# Altium schematic sheet SUBBOARD-sensors.SchDoc
size A4
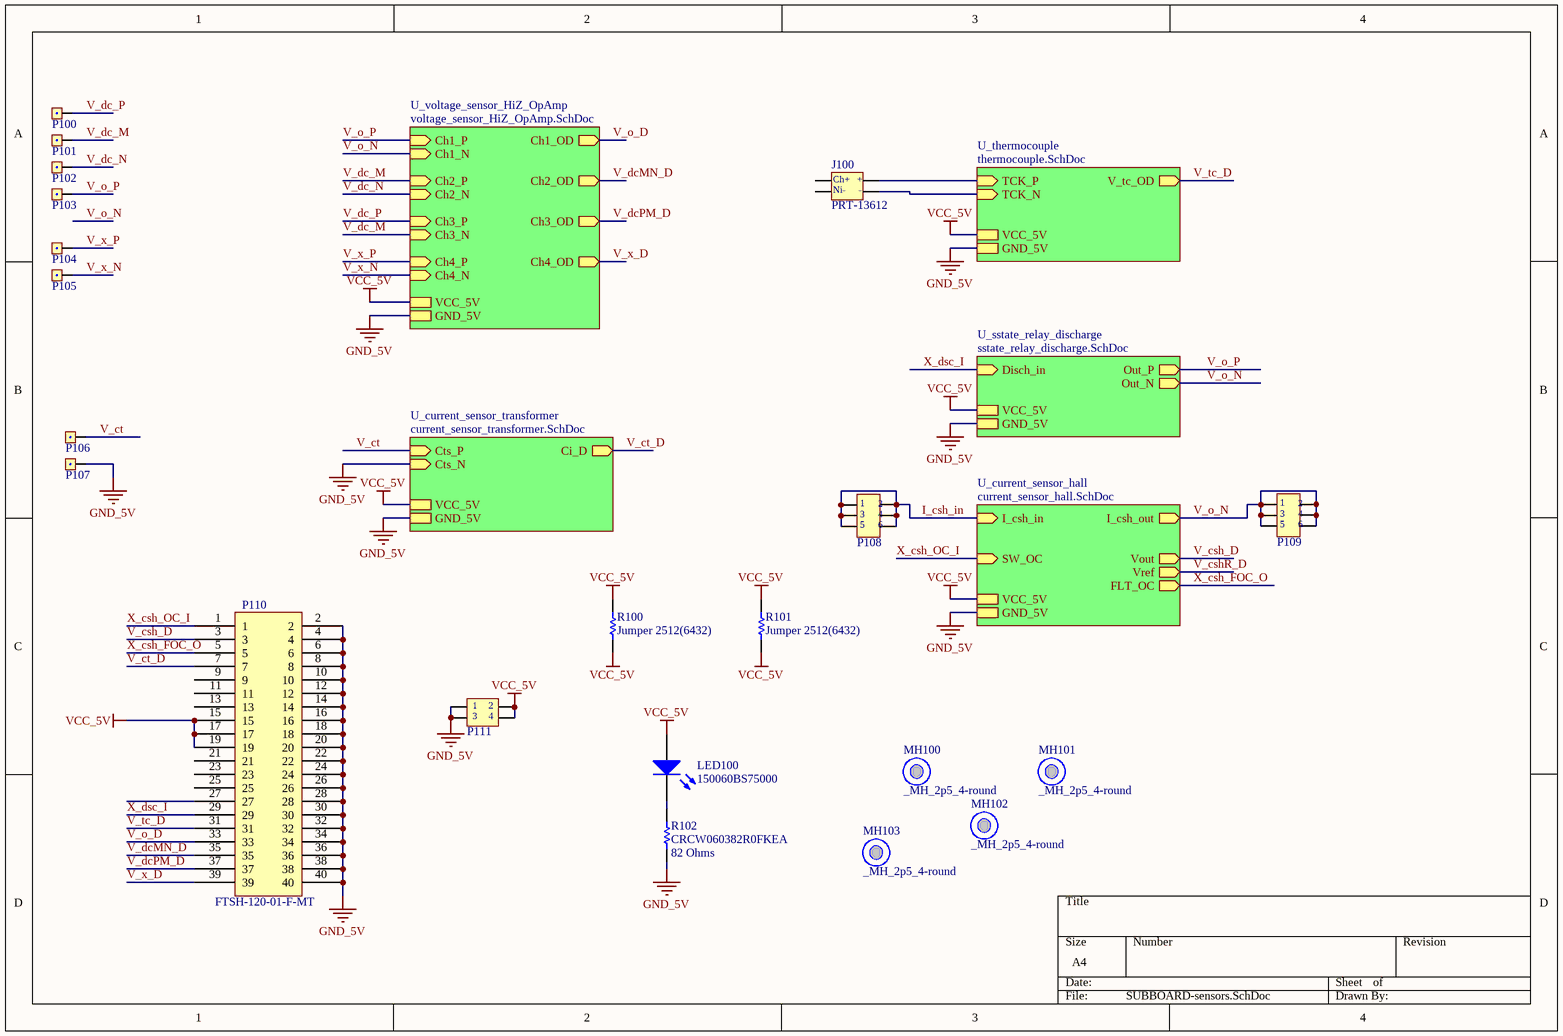
[diagram p0: SUBBOARD-sensors.SchDoc]

## Parts
J100  PRT-13612  [PRT-13612]
LED100  150060BS75000  [0603_A]
MH100  _MH_2p5_4-round  [_MH_2p5_4-round]
MH101  _MH_2p5_4-round  [_MH_2p5_4-round]
MH102  _MH_2p5_4-round  [_MH_2p5_4-round]
MH103  _MH_2p5_4-round  [_MH_2p5_4-round]
P100  TSW-101-15-G-S  [TSW-101-15-G-S]  (value not drawn)
P101  TSW-101-15-G-S  [TSW-101-15-G-S]  (value not drawn)
P102  TSW-101-15-G-S  [TSW-101-15-G-S]  (value not drawn)
P103  TSW-101-15-G-S  [TSW-101-15-G-S]  (value not drawn)
P104  TSW-101-15-G-S  [TSW-101-15-G-S]  (value not drawn)
P105  TSW-101-15-G-S  [TSW-101-15-G-S]  (value not drawn)
P106  TSW-101-15-G-S  [TSW-101-15-G-S]  (value not drawn)
P107  TSW-101-15-G-S  [TSW-101-15-G-S]  (value not drawn)
P108  TSW-103-15-G-D  [TSW-103-15-G-D]  (value not drawn)
P109  TSW-103-15-G-D  [TSW-103-15-G-D]  (value not drawn)
P110  FTSH-120-01-F-MT  [FTSH-120-01-F-MT]
P111  TMM-102-02-T-D  [TMM-102-02-T-D]  (value not drawn)
R100  Jumper 2512(6432)  [RESC2512(6432)_L]
R101  Jumper 2512(6432)  [RESC2512(6432)_L]
R102  CRCW060382R0FKEA  value 82 Ohms  [RESC1609X50X30LL10T20]

## Sub-sheets
U_current_sensor_hall = current_sensor_hall.SchDoc: I_csh_in (in), I_csh_out (out), VCC_5V, GND_5V, Vout (out), Vref (out), FLT_OC (out), SW_OC (in)
U_current_sensor_transformer = current_sensor_transformer.SchDoc: VCC_5V, GND_5V, Cts_P (in), Cts_N (in), Ci_D (out)
U_sstate_relay_discharge = sstate_relay_discharge.SchDoc: VCC_5V, GND_5V, Disch_in (in), Out_P (out), Out_N (out)
U_thermocouple = thermocouple.SchDoc: V_tc_OD (out), VCC_5V, GND_5V, TCK_P (in), TCK_N (in)
U_voltage_sensor_HiZ_OpAmp = voltage_sensor_HiZ_OpAmp.SchDoc: VCC_5V, GND_5V, Ch1_OD (out), Ch2_OD (out), Ch3_OD (out), Ch4_OD (out), Ch1_N (in), Ch1_P (in), Ch2_N (in), Ch2_P (in), Ch3_N (in), Ch3_P (in), Ch4_N (in), Ch4_P (in)

## Nets
GND_5V: P107.1 P110.2 P110.4 P110.6 P110.8 P110.10 P110.12 P110.14 P110.16 P110.18 P110.20 P110.22 P110.24 P110.26 P110.28 P110.30 P110.32 P110.34 P110.36 P110.38 P110.40 P111.1 P111.3 R102.2 ; sheet U_voltage_sensor_HiZ_OpAmp/GND_5V, sheet U_current_sensor_hall/GND_5V, sheet U_current_sensor_transformer/GND_5V, sheet U_current_sensor_transformer/Cts_N, sheet U_thermocouple/GND_5V, sheet U_sstate_relay_discharge/GND_5V
VCC_5V: LED100.2(A) P110.15 P110.17 P110.19 P111.2 P111.4 R100.1 R100.2 R101.1 R101.2 ; sheet U_voltage_sensor_HiZ_OpAmp/VCC_5V, sheet U_current_sensor_hall/VCC_5V, sheet U_current_sensor_transformer/VCC_5V, sheet U_thermocouple/VCC_5V, sheet U_sstate_relay_discharge/VCC_5V
I_csh_in: P108.1 P108.2 P108.3 P108.4 P108.5 P108.6 ; sheet U_current_sensor_hall/I_csh_in
V_csh_D: P110.3 ; sheet U_current_sensor_hall/Vout
V_cshR_D: sheet U_current_sensor_hall/Vref
V_ct: P106.1 ; sheet U_current_sensor_transformer/Cts_P
V_ct_D: P110.7 ; sheet U_current_sensor_transformer/Ci_D
V_dc_M: P101.1 ; sheet U_voltage_sensor_HiZ_OpAmp/Ch2_P, sheet U_voltage_sensor_HiZ_OpAmp/Ch3_N
V_dc_N: P102.1 ; sheet U_voltage_sensor_HiZ_OpAmp/Ch2_N
V_dc_P: P100.1 ; sheet U_voltage_sensor_HiZ_OpAmp/Ch3_P
V_dcMN_D: P110.35 ; sheet U_voltage_sensor_HiZ_OpAmp/Ch2_OD
V_dcPM_D: P110.37 ; sheet U_voltage_sensor_HiZ_OpAmp/Ch3_OD
V_o_D: P110.33 ; sheet U_voltage_sensor_HiZ_OpAmp/Ch1_OD
V_o_N: P109.1 P109.2 P109.3 P109.4 P109.5 P109.6 ; sheet U_voltage_sensor_HiZ_OpAmp/Ch1_N, sheet U_current_sensor_hall/I_csh_out, sheet U_sstate_relay_discharge/Out_N
V_o_P: P103.1 ; sheet U_voltage_sensor_HiZ_OpAmp/Ch1_P, sheet U_sstate_relay_discharge/Out_P
V_tc_D: P110.31 ; sheet U_thermocouple/V_tc_OD
V_x_D: P110.39 ; sheet U_voltage_sensor_HiZ_OpAmp/Ch4_OD
V_x_N: P105.1 ; sheet U_voltage_sensor_HiZ_OpAmp/Ch4_N
V_x_P: P104.1 ; sheet U_voltage_sensor_HiZ_OpAmp/Ch4_P
X_csh_FOC_O: P110.5 ; sheet U_current_sensor_hall/FLT_OC
X_csh_OC_I: P110.1 ; sheet U_current_sensor_hall/SW_OC
X_dsc_I: P110.29 ; sheet U_sstate_relay_discharge/Disch_in
NetJ100_3: J100.3 ; sheet U_thermocouple/TCK_P
NetJ100_4: J100.4 ; sheet U_thermocouple/TCK_N
NetLED100_1: LED100.1(K) R102.1

Not connected (* = marked no-connect by the designer): J100 1 2; P110 9 11 13 21 23 25 27

## Notes on the sheet
- (in symbol PRT-13612) Ch+; +; Ni-; -

## Library data of the parts
J100 = PRT-13612: THERMOCOUPLE CONN - PCC-SMP-K; Manufacturer: SparkFun; System: Connector; Supplier 1: Digi-Key; Manufacturer Part Number: PRT-13612; RoHS: No; Stock 1: 201; Pricing 1: 1=4.38000 (USD); ComponentLink1URL: https://cdn.sparkfun.com/datasheets/Prototyping/PCC-SMP-K-datasheet.pdf?src-supplier=Digi-Key; ComponentLink1Description: https://cdn.sparkfun.com/datasheets/Prototyping/PCC-SMP-K-datasheet.pdf?src-supplier=Digi-Key; Supplier Part Number 1: 1568-1306-ND
LED100 = CMP-1426-00003-1: SMD mono-color Chip LED, WL-SMCW, Blue; Manufacturer: Wuerth Elektronik; Color: Blue; ComponentLink2Description: Datasheet; ComponentLink2URL: http://katalog.we-online.com/led/datasheet/150060BS75000.pdf; ComponentLink1URL: http://www.we-online.com; PackageReference: 0603_A; PartNumber: 150060BS75000; ComponentLink1Description: Manufacturer URL
MH100-MH103 = _MH_2p5_4-round: matching hole 2.5 hole, 4mm pad (round)
P100-P107 = TSW-101-15-G-S: Conn Unshrouded Header HDR 1 POS Solder ST Thru-Hole; Manufacturer: Samtec; Gender: Male; Max Current Rating: 7.6A; Max Voltage Rating (AC): 550V; Number of Contacts: 1; System: Connector; Supplier 1: Digi-Key; Manufacturer Part Number: TSW-101-15-G-S; RoHS: Yes; Category: Connectors; Stock 1: 1116; Pricing 1: 1=0.16000 (USD); Mount: Through Hole; Housing Material: Polyester; Housing Color: Black; Contact Material: Bronze; Contact Plating: Gold; Min Operating Temperature: -55°C; Max Operating Temperature: 125°C; Orientation: Straight; Number of Rows: 1; Packaging: Bulk; Termination: Solder; Length: 2.54mm; Depth: 2.54mm; Radiation Hardening: No; REACH SVHC: No SVHC; ComponentLink1URL: https://datasheet.ciiva.com/16736/htsw-th-16736491.pdf?src-supplier=Avnet+Europe; ComponentLink1Description: https://datasheet.ciiva.com/16736/htsw-th-16736491.pdf?src-supplier=Avnet+Europe; ComponentLink2URL: https://datasheet.ciiva.com/10337/htsw-th-10337087.pdf?src-supplier=Avnet; ComponentLink2Description: https://datasheet.ciiva.com/10337/htsw-th-10337087.pdf?src-supplier=Avnet; Supplier Part Number 1: TSW-101-15-G-S-ND
P108 P109 = TSW-103-15-G-D: .025" SQ. TERMINAL STRIPS; Manufacturer: Samtec; Number of Contacts: 6; Gender: Male; Max Voltage Rating (AC): 550V; Max Current Rating: 7.6A; Pitch: 2.54mm; System: Connector; Supplier 1: Digi-Key; Manufacturer Part Number: TSW-103-15-G-D; RoHS: Yes; Category: Headers and Wire Housings; Stock 1: 480; Pricing 1: 1=0.78000, 10=0.73200, 100=0.56120, 500=0.48800, 1000=0.40260, 5000=0.35380, 10000=0.32940 (USD); Contact Plating: Gold; Contact Material: Bronze; Housing Material: Polyester; Housing Color: Black; Min Operating Temperature: -55°C; Max Operating Temperature: 125°C; Termination: Solder; Number of Rows: 2; Packaging: Bulk; Orientation: Straight; Length: 7.62mm; Row Spacing: 2.54mm; Depth: 5.08mm; Radiation Hardening: No; REACH SVHC: No SVHC; ComponentLink1URL: https://datasheet.ciiva.com/16723/htsw-th-16723063.pdf?src-supplier=Avnet+Europe; ComponentLink1Description: https://datasheet.ciiva.com/16723/htsw-th-16723063.pdf?src-supplier=Avnet+Europe; ComponentLink2URL: https://datasheet.ciiva.com/29947/htsw-th-29947802.pdf?src-supplier=Avnet; ComponentLink2Description: https://datasheet.ciiva.com/29947/htsw-th-29947802.pdf?src-supplier=Avnet; Supplier Part Number 1: SAM12306-ND
P110 = FTSH-120-01-F-MT: Conn Unshrouded Header HDR 40 POS 1.27mm Solder RA Thru-Hole/SMD Tube; Manufacturer: Samtec; Number of Contacts: 40; Gender: Male; System: Connector; Supplier 1: Digi-Key; Manufacturer Part Number: FTSH-120-01-F-MT; RoHS: Yes; Category: Headers and Wire Housings; Stock 1: 47; Pricing 1: 1=5.48000 (USD); Contact Plating: Gold; Contact Material: Bronze; Housing Material: Polymer; Housing Color: Black; Min Operating Temperature: -55°C; Max Operating Temperature: 125°C; Number of Rows: 2; Termination: Solder; Packaging: Rail/Tube; Orientation: Right Angle; Length: 25.4mm; Pitch: 1.27mm; Depth: 10.64mm; Radiation Hardening: No; Lead Free: Lead Free; ComponentLink1URL: https://datasheet.ciiva.com/16697/ftsh-mt-16697612.pdf?src-supplier=Avnet+Europe; ComponentLink1Description: https://datasheet.ciiva.com/16697/ftsh-mt-16697612.pdf?src-supplier=Avnet+Europe; Supplier Part Number 1: FTSH-120-01-F-MT-ND; Supplier 2: Avnet; Pricing 2: 1=5.23577, 10=4.92660, 30=4.79780, 50=4.57240, 100=4.37920 (USD); Supplier 3: Newark; Pricing 3: 1=5.48000, 10=5.04000, 25=4.62000, 50=4.43000, 100=4.21000, 250=3.68000, 500=3.57000 (USD); Supplier Part Number 2: FTSH-120-01-F-MT; Supplier Part Number 3: 01R7043
P111 = TMM-102-02-T-D: SAMTEC         TMM-102-02-T-D             Board-To-Board Connector, TMM Series, 4 Contacts, Header, 2 mm, Through Hole, 2 Rows; Gender: Male; Number of Contacts: 4; Pitch: 2mm; Supplier 1: Digi-Key; Manufacturer: Samtec; Manufacturer Part Number: TMM-102-02-T-D; RoHS: Yes; Category: Connectors; Stock 1: 996; Pricing 1: 1=0.36000 (USD); Mount: Through Hole; Contact Plating: Tin; Contact Material: Bronze; Packaging: Bulk; Number of Rows: 2; Termination: Solder; Radiation Hardening: No; Lead Free: Lead Free; REACH SVHC: No SVHC; ComponentLink1URL: http://www.farnell.com/datasheets/2047777.pdf?src-supplier=Farnell; ComponentLink1Description: http://www.farnell.com/datasheets/2047777.pdf?src-supplier=Farnell; ComponentLink2URL: ftp://ftp.samtec.com/webfiles/PDF/TMM_TH.PDF?src-supplier=Avnet; ComponentLink2Description: ftp://ftp.samtec.com/webfiles/PDF/TMM_TH.PDF?src-supplier=Avnet; Supplier Part Number 1: TMM-102-02-T-D-ND; System: Connector
R100 R101 = CMP-1018-00001-1: Jumper 2512 (6432 Metric); Tolerance: None; Case-EIA: 2512; Value: 0.00 Ohm; Case-Metric: 6432; Technology: SMT; Power: None
R102 = CMP-2000-03606-1: Manufacturer: Vishay Dale; Part Number: CRCW060382R0FKEA